# EAGLE design IR_Light_Controller (EAGLE 7.7.0)
Assembly variants: i2c yok
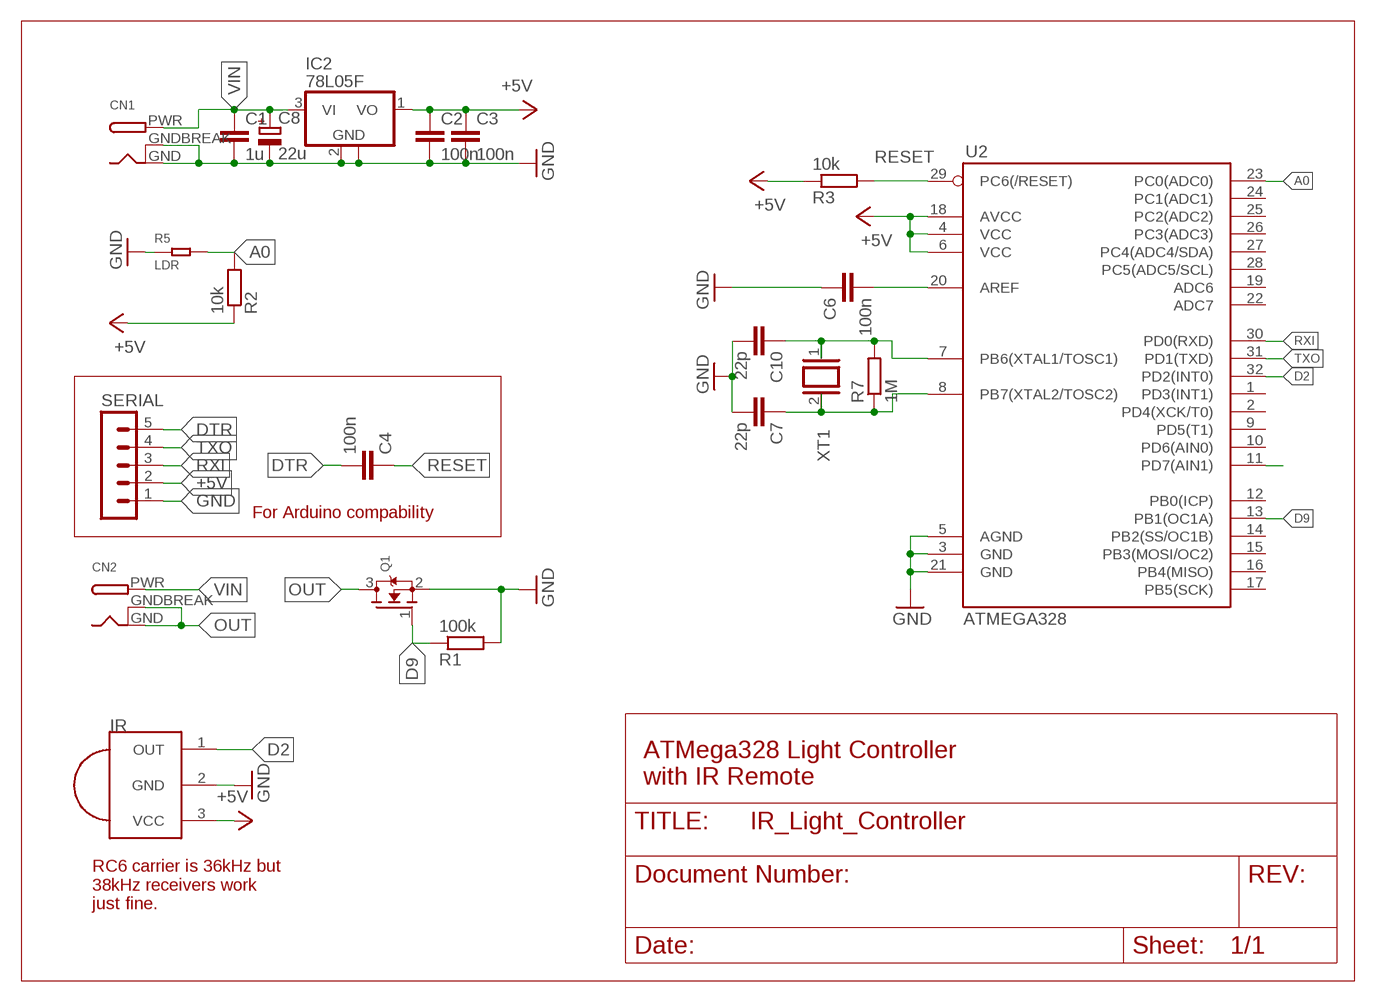
[diagram p0: schematic, sheet 1]

## Parts
C1  1u  C-EUC0805  [C0805]
C2  100n  C-EUC0805  [C0805]
C3  100n  C-EUC0805  [C0805]
C4  100n  C-EUC0805K  [C0805K]
C6  100n  C-EUC0805K  [C0805K]
C7  22p  C-EUC0805K  [C0805K]
C8  22u  CPOL-EUE2-4  [E2-4]
C10  22p  C-EUC0805K  [C0805K]
CN1  DCBARRELPTH  [DCJACK_2MM_PTH]
CN2  DCBARRELPTH  [DCJACK_2MM_PTH]
IC2  78L05F  [SOT89]
IR  PNA460XM  [PNA460XM]
Q1  MOSFET-NWAVE  [SOT23-W]
R1  100k  R-EU_M0805  [M0805]
R2  10k  R-EU_M0805  [M0805]
R3  10k  R-EU_M0805  [M0805]
R5  LDR  DIP-RES-LDR(2P-D2.3X3.7MM)  [PR-2.8-4.2X4.9MM]
R7  1M  R-EU_M0805  [M0805]
SERIAL  MA05-1  [MA05-1]
U2  ATMEGA328  ATMEGA168  [TQFP32-08]
XT1  XTAL/S  [QS]

## Nets
+5V: C2.1 C3.1 IC2.1(VO) IR.3(VCC) R2.1 R3.1 SERIAL.2 U2.4(VCC) U2.6(VCC) U2.18(AVCC)
A0: R2.2 R5.2 U2.23(PC0(ADC0))
AREF: C6.2 U2.20(AREF)
D2: IR.1(OUT) U2.32(PD2(INT0))
D7: U2.11(PD7(AIN1))
D9: Q1.1(G) R1.1 U2.13(PB1(OC1A))
DTR: C4.2 SERIAL.5
GND: C1.2 C2.2 C3.2 C6.1 C7.2 C8.- C10.2 CN1.GND CN1.GNDBREAK IC2.2(GND) IC2.2@1(GND) IR.2(GND) Q1.2(S) R1.2 R5.1 SERIAL.1 U2.3(GND) U2.5(AGND) U2.21(GND)
OUT: CN2.GND CN2.GNDBREAK Q1.3(D)
RESET: C4.1 R3.2 U2.29(PC6(/RESET))
RXI: SERIAL.3 U2.30(PD0(RXD))
TXO: SERIAL.4 U2.31(PD1(TXD))
VIN: C1.1 C8.+ CN1.PWR CN2.PWR IC2.3(VI)
XT1: C10.1 R7.2 U2.7(PB6(XTAL1/TOSC1)) XT1.1
XT2: C7.1 R7.1 U2.8(PB7(XTAL2/TOSC2)) XT1.2
Unconnected: U2.1(PD3(INT1)) U2.2(PD4(XCK/T0)) U2.9(PD5(T1)) U2.10(PD6(AIN0)) U2.12(PB0(ICP)) U2.14(PB2(SS/OC1B)) U2.15(PB3(MOSI/OC2)) U2.16(PB4(MISO)) U2.17(PB5(SCK)) U2.19(ADC6) U2.22(ADC7) U2.24(PC1(ADC1)) U2.25(PC2(ADC2)) U2.26(PC3(ADC3)) U2.27(PC4(ADC4/SDA)) U2.28(PC5(ADC5/SCL))

## Notes on the sheet
- For Arduino compability
- ATMega328 Light Controller
  with IR Remote
- RC6 carrier is 36kHz but 
  38kHz receivers work 
  just fine.

## Library data of the parts
C1-C4 C6 C7 C10 = rcl:C-EU: CAPACITOR, European symbol
C8 = rcl:CPOL-EU: POLARIZED CAPACITOR, European symbol
CN1 CN2 = adafruit:DCBARREL: 2.0mm DC Barrel Jack DCJACK_2MM_PTH - Through Hole Jack (4UConnector: 05537)
IC2 = linear:78L*: POSITOIV-VOLTAGE REGULATORS Output up to 100 mA Source: Datasheet <http://focus.ti.com/lit/ds/symlink/ua78l05.pdf>
IR = adafruit:PNA460XM: IR 38KHz receiver PNA4602 and related receivers http://www.ladyada.net/library/pcb/eaglelibrary.html
Q1 = adafruit:MOSFET-N: N-Channel Mosfet 2N7002E - 60V 260mA SOT23 [Digikey: 2N7002ET1GOSTR-ND] - REEL BSH103 - 30V 850mA SOT23 [Digikey: 568-5013-1-ND]
R1-R3 R7 = rcl:R-EU_: RESISTOR, European symbol
R5 = Seeed-OPL-Resistor:DIP-RES-LDR(2P-D2.3X3.7MM): 314120003; MPN: LDR-VT90N2
SERIAL = con-lstb:MA05-1: PIN HEADER; OC_FARNELL: unknown; OC_NEWARK: unknown
U2 = SparkFun:ATMEGA168
XT1 = special:XTAL/S: CRYSTAL

## Net classes
1 vcc: width 0.254 mm
2 gnd: width 0.203 mm, drill 0.559 mm, clearance 0.152 mm

## Board
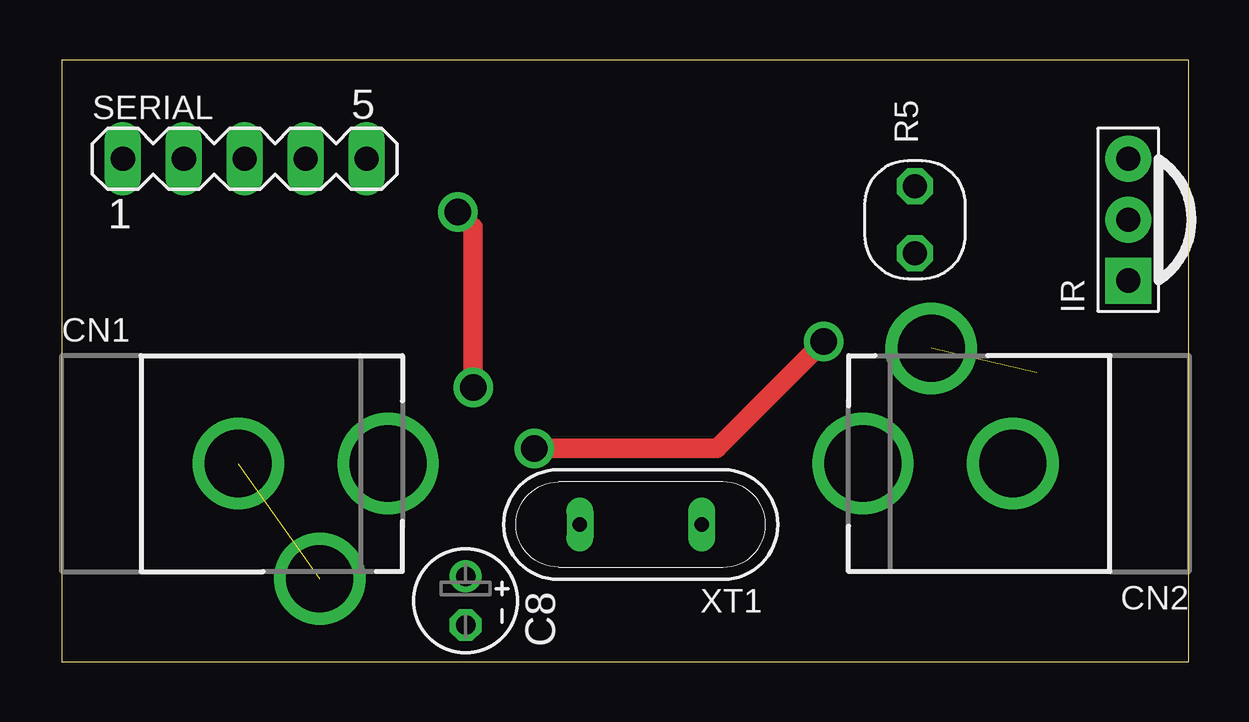
[diagram p1: board, top side]
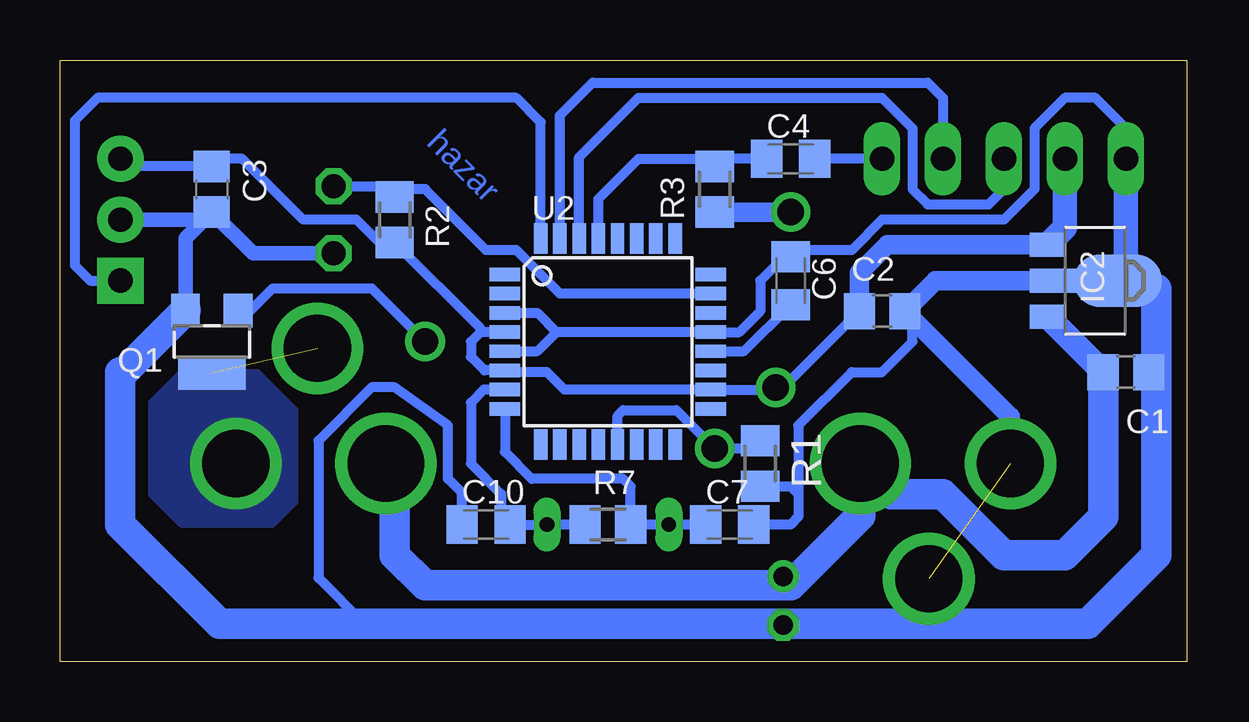
[diagram p2: board, bottom side, seen from below]

Size 46.97 x 25.07 mm. Coordinates in mm from the lower left corner, seen from the top.
Outline: 0,0 46.97,0 46.97,25.07 0,25.07 0,0
Copper layers (1*16): Top 0.035mm / dielectric 1.5mm / Bottom 0.035mm
Design rules "default": minimum track width 10mil, minimum drill 24mil, track to track 8mil, track to pad 8mil, pad to pad 8mil, via to via 8mil, smd to smd 8mil, copper to edge 40mil, drill to drill 8mil, minimum pad ring 10mil, minimum via ring 8mil, stop-mask expansion 4mil, vias tented up to drill 0mil, thermal gap 10mil

### Footprints (pad centres in the part's own frame; a part is rotated, then mirrored left to right if it is on the bottom)
C0805 = smd 1.3 x 1.5: 1 -0.95,0; 2 0.95,0
C0805K = smd 1.3 x 1.6: 1 -1,0; 2 1,0
E2-4 = drill 0.813 pad 1.27: + -1.016,0 | drill 0.813 pad 1.27 octagon: - 1.016,0
DCJACK_2MM_PTH = drill 2.8: GND 0,7.35; GNDBREAK 4.8,10.75 | drill 3.2: PWR 0,13.6
SOT89 = smd 1 x 1.5: 1 -1.499,-1.981; 3 1.499,-1.981 | smd 1 x 2: 2 0,-1.727 | smd 2.2 x 3.7: 2@1 0,0.94
PNA460XM = drill 1.016 pad 1.93 square: 1 -2.54,0 | drill 1.016 pad 1.93: 2 0,0; 3 2.54,0
SOT23-W = smd 1.2 x 1.4: 1 -1.1,-1.3; 2 1.1,-1.3 | smd 2.8 x 1.4: 3 0,1.3
M0805 = smd 1.3 x 1.6: 1 -0.95,0; 2 0.95,0
PR-2.8-4.2X4.9MM = drill 1 octagon: 1 0,-1.4; 2 0,1.4
MA05-1 = drill 1.016 long: 1 -5.08,0; 2 -2.54,0; 3 0,0; 4 2.54,0; 5 5.08,0
TQFP32-08 = smd 1.27 x 0.559: 1 -4.293,2.8; 2 -4.293,2; 3 -4.293,1.2; 4 -4.293,0.4; 5 -4.293,-0.4; 6 -4.293,-1.2; 7 -4.293,-2; 8 -4.293,-2.8; 17 4.293,-2.8; 18 4.293,-2; 19 4.293,-1.2; 20 4.293,-0.4; 21 4.293,0.4; 22 4.293,1.2; 23 4.293,2; 24 4.293,2.8 | smd 0.559 x 1.27: 9 -2.8,-4.293; 10 -2,-4.293; 11 -1.2,-4.293; 12 -0.4,-4.293; 13 0.4,-4.293; 14 1.2,-4.293; 15 2,-4.293; 16 2.8,-4.293; 25 2.8,4.293; 26 2,4.293; 27 1.2,4.293; 28 0.4,4.293; 29 -0.4,4.293; 30 -1.2,4.293; 31 -2,4.293; 32 -2.8,4.293
QS = drill 0.61 long: 1 -2.54,0; 2 2.54,0

### Placement (x,y rotation side)
C1  2.54,12.06 0 bottom
C2  12.7,14.61 0 bottom
C3  40.64,19.69 270 bottom
C4  16.51,20.96 0 bottom
C6  16.51,15.88 270 bottom
C7  19.05,5.71 0 bottom
C8  16.83,2.54 270 top
C10  29.21,5.71 180 bottom
CN1  0,8.26 270 top
CN2  46.99,8.26 90 top
IC2  3.81,15.88 270 bottom
IR  44.45,18.42 90 top
Q1  40.64,13.33 180 bottom
R1  17.78,8.26 270 bottom
R2  33.02,18.42 90 bottom
R3  19.68,19.69 90 bottom
R5  35.56,18.42 0 top
R7  24.13,5.71 180 bottom
SERIAL  7.62,20.96 0 top
U2  24.13,13.33 0 bottom
XT1  24.13,5.71 180 top

### Tracks (layer width: path | path; a pad name or v marks a point on that pad's centre or on a via)
+5V  (via drill 1.1)
  Top 0.813: v17.14,11.43 17.14,18.1 v16.51,18.73
  Bottom 0.406: U2.4 29.45,13.73 | 29.45,13.73 29.84,13.33 29.84,12.7 29.28,12.13 U2.6 28.35,12.06 26.67,12.06 25.94,11.33 U2.18 16.92,11.33 | 29.45,13.73 29.45,13.89 R2.1 33.66,17.46 34.61,18.42 36.83,18.42 39.37,20.96 40.32,20.96 C3.1 44.13,20.64 IR.3 | 16.92,11.33 C2.1 | v17.14,11.43 17.02,11.43 16.92,11.33
  Bottom 0.813: IC2.1 12.47,17.37 13.65,16.2 C2.1 | R3.1 v16.51,18.74 v16.51,18.73
  Bottom 1.016: SERIAL.2 5.08,18.09 IC2.1
A0
  Bottom 0.406: R5.2 33.47,19.82 R2.2 32.7,19.69 31.75,19.69 29.21,17.15 27.94,17.15 26.13,15.33 U2.23
AREF
  Bottom 0.406: U2.20 18.45,12.94 C6.2
D2
  Bottom 0.406: U2.32 26.93,22.49 27.94,23.5 45.4,23.5 46.35,22.54 46.35,16.51 45.72,15.88 IR.1
D9  (via drill 1.1)
  Top 0.813: v19.68,8.89 27.3,8.89 v31.75,13.33
  Bottom 0.406: v31.75,13.33 33.97,15.56 38.1,15.56 39.02,14.63 Q1.1 | U2.13 23.73,10.24 23.5,10.48 21.27,10.48 v19.68,8.89 18.09,8.89 R1.1
DTR
  Bottom 0.406: SERIAL.5 C4.2
GND  (1 unrouted)
  Bottom 0.406: U2.5 27.07,12.94 26.27,13.73 | 26.27,13.73 U2.21 18.65,13.73 17.78,14.61 17.78,15.88 16.78,16.88 C6.1 16.24,17.15 13.97,17.15 12.7,18.42 7.62,18.42 6.35,19.69 6.35,22.23 5.08,23.5 3.81,23.5 2.54,22.23 SERIAL.1 | U2.3 27.07,14.54 26.27,13.73 | C2.2 11.43,14.29 11.43,13.33 12.7,12.06 13.97,12.06 16.19,9.84 16.19,6.98 | C10.2 30.21,7.03 30.8,7.62 30.8,9.84 33.02,11.43 33.97,11.43 36.2,9.21 36.2,3.49 34.29,1.59 | 16.19,6.98 16.19,6.03 16.51,5.71 C7.2 | R1.2 16.51,7.3 16.19,6.98
  Bottom 0.61: 1.27,11.74 C1.2 | IR.2 40.96,18.42 C3.2 | Q1.2 41.74,17.64 C3.2 | R5.1 38.92,17.02 C3.2
  Bottom 0.813: IC2.2 10.48,15.88 C2.2 7.35,10.21 CN1.GND | C8.- 16.57,1.52 16.51,1.59
  Bottom 1.016: IC2.2 IC2.2@1 | IC2.2@1 2.54,15.88 | SERIAL.1 2.54,16.21 IC2.2@1
  Bottom 1.27: C1.2 1.27,12.38 | IC2.2@1 1.27,15.54 1.27,12.38 | 1.27,12.38 1.27,4.45 4.13,1.59 16.51,1.59 34.29,1.59 40.32,1.59 44.45,5.71 44.45,12.06 44.31,12.06 Q1.2
OUT  (1 unrouted)
  pour Bottom (isolate 0.406, no thermals): 38.73,12.06 41.91,12.06 43.18,10.79 43.18,6.98 41.91,5.71 38.1,5.71 37.15,6.67 37.15,10.48
RESET
  Bottom 0.406: U2.29 24.53,19.29 22.86,20.96 20,20.96 R3.2 19.36,20.96 C4.1
RXI
  Bottom 0.406: U2.30 25.33,21.03 22.86,23.5 12.7,23.5 11.43,22.23 11.43,19.69 10.79,19.05 8.26,19.05 7.62,19.69 SERIAL.3
TXO
  Bottom 0.406: U2.31 26.13,22.77 24.77,24.13 10.79,24.13 10.16,23.5 SERIAL.4
VIN
  Bottom 0.813: C8.+ 16.83,3.49 16.51,3.17
  Bottom 1.016: IC2.3 C1.1
  Bottom 1.27: CN2.PWR 33.02,6.62 33.02,4.45 31.75,3.17 16.51,3.17 13.6,6.08 CN1.PWR 12.33,6.98 10.16,6.98 7.62,4.45 5.08,4.45 3.49,6.04 C1.1
XT1
  Bottom 0.406: R7.2 XT1.1 C10.1 28.57,6.08 28.57,6.98 29.84,8.26 29.84,10.79 29.3,11.33 U2.7
XT2
  Bottom 0.406: C7.1 XT1.2 R7.1 23.18,7.3 23.5,7.62 27.3,7.62 28.42,8.74 U2.8

### Text on the board
Bottom: hazar
Notes: Do not mind 2 airwires at DC barrel sockets. / It is not connected.